# EAGLE design candle (EAGLE 6.6.0)
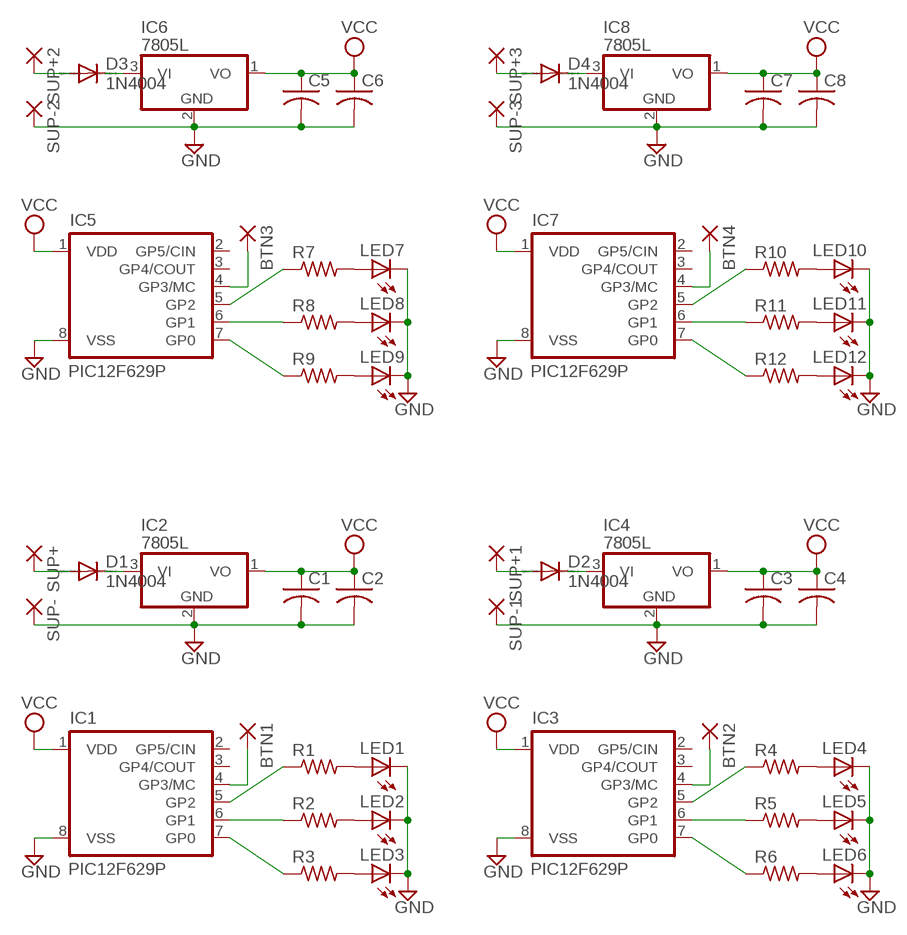
[diagram p0: schematic, sheet 1]

## Parts
BTN1  1,6/0,8  [1,6/0,8]
BTN2  1,6/0,8  [1,6/0,8]
BTN3  1,6/0,8  [1,6/0,8]
BTN4  1,6/0,8  [1,6/0,8]
C1  C-US025-025X050  [C025-025X050]
C2  C-US025-025X050  [C025-025X050]
C3  C-US025-025X050  [C025-025X050]
C4  C-US025-025X050  [C025-025X050]
C5  C-US025-025X050  [C025-025X050]
C6  C-US025-025X050  [C025-025X050]
C7  C-US025-025X050  [C025-025X050]
C8  C-US025-025X050  [C025-025X050]
D1  1N4004  [DO41-10]
D2  1N4004  [DO41-10]
D3  1N4004  [DO41-10]
D4  1N4004  [DO41-10]
IC1  PIC12F629P  PIC12C671P  [DIL8]
IC2  7805L  [TO92]
IC3  PIC12F629P  PIC12C671P  [DIL8]
IC4  7805L  [TO92]
IC5  PIC12F629P  PIC12C671P  [DIL8]
IC6  7805L  [TO92]
IC7  PIC12F629P  PIC12C671P  [DIL8]
IC8  7805L  [TO92]
LED1  LED5MM  [LED5MM]
LED2  LED5MM  [LED5MM]
LED3  LED5MM  [LED5MM]
LED4  LED5MM  [LED5MM]
LED5  LED5MM  [LED5MM]
LED6  LED5MM  [LED5MM]
LED7  LED5MM  [LED5MM]
LED8  LED5MM  [LED5MM]
LED9  LED5MM  [LED5MM]
LED10  LED5MM  [LED5MM]
LED11  LED5MM  [LED5MM]
LED12  LED5MM  [LED5MM]
R1  R-US_0204/7  [0204/7]
R2  R-US_0204/7  [0204/7]
R3  R-US_0204/7  [0204/7]
R4  R-US_0204/7  [0204/7]
R5  R-US_0204/7  [0204/7]
R6  R-US_0204/7  [0204/7]
R7  R-US_0204/7  [0204/7]
R8  R-US_0204/7  [0204/7]
R9  R-US_0204/7  [0204/7]
R10  R-US_0204/7  [0204/7]
R11  R-US_0204/7  [0204/7]
R12  R-US_0204/7  [0204/7]
SUP+  1,6/0,8  [1,6/0,8]
SUP+1  1,6/0,8  [1,6/0,8]
SUP+2  1,6/0,8  [1,6/0,8]
SUP+3  1,6/0,8  [1,6/0,8]
SUP-  1,6/0,8  [1,6/0,8]
SUP-1  1,6/0,8  [1,6/0,8]
SUP-2  1,6/0,8  [1,6/0,8]
SUP-3  1,6/0,8  [1,6/0,8]

## Nets
GND: C1.2 C2.2 C3.2 C4.2 C5.2 C6.2 C7.2 C8.2 IC1.8(VSS) IC2.2(GND) IC3.8(VSS) IC4.2(GND) IC5.8(VSS) IC6.2(GND) IC7.8(VSS) IC8.2(GND) LED1.K(C) LED2.K(C) LED3.K(C) LED4.K(C) LED5.K(C) LED6.K(C) LED7.K(C) LED8.K(C) LED9.K(C) LED10.K(C) LED11.K(C) LED12.K(C) SUP-1.1(P) SUP-2.1(P) SUP-3.1(P) SUP-.1(P)
N$1: IC3.7(GP0) R6.1
N$2: BTN1.1(P) IC1.4(GP3/MC)
N$3: IC1.7(GP0) R3.1
N$4: IC1.6(GP1) R2.1
N$5: IC1.5(GP2) R1.1
N$6: LED1.A R1.2
N$7: LED2.A R2.2
N$8: LED3.A R3.2
N$9: IC3.6(GP1) R5.1
N$10: D1.C IC2.3(VI)
N$11: IC3.5(GP2) R4.1
N$12: LED4.A R4.2
N$13: LED5.A R5.2
N$14: LED6.A R6.2
N$15: D2.C IC4.3(VI)
N$16: BTN2.1(P) IC3.4(GP3/MC)
N$17: IC5.7(GP0) R9.1
N$18: IC5.6(GP1) R8.1
N$19: IC5.5(GP2) R7.1
N$21: LED7.A R7.2
N$22: LED8.A R8.2
N$23: D3.C IC6.3(VI)
N$24: BTN3.1(P) IC5.4(GP3/MC)
N$25: IC7.7(GP0) R12.1
N$26: IC7.6(GP1) R11.1
N$27: IC7.5(GP2) R10.1
N$28: LED9.A R9.2
N$29: LED10.A R10.2
N$30: LED11.A R11.2
N$31: D4.C IC8.3(VI)
N$32: BTN4.1(P) IC7.4(GP3/MC)
N$33: D1.A SUP+.1(P)
N$34: LED12.A R12.2
N$35: D3.A SUP+2.1(P)
N$36: D4.A SUP+3.1(P)
N$37: D2.A SUP+1.1(P)
VCC: C1.1 C2.1 C3.1 C4.1 C5.1 C6.1 C7.1 C8.1 IC1.1(VDD) IC2.1(VO) IC3.1(VDD) IC4.1(VO) IC5.1(VDD) IC6.1(VO) IC7.1(VDD) IC8.1(VO)
Unconnected: IC1.2(GP5/CIN) IC1.3(GP4/COUT) IC3.2(GP5/CIN) IC3.3(GP4/COUT) IC5.2(GP5/CIN) IC5.3(GP4/COUT) IC7.2(GP5/CIN) IC7.3(GP4/COUT)

## Library data of the parts
BTN1-BTN4 SUP+ SUP+1-SUP+3 SUP- SUP-1-SUP-3 = wirepad:1,6/0,8: THROUGH-HOLE PAD
C1-C8 = rcl:C-US: CAPACITOR, American symbol
D1-D4 = diode:1N4004: DIODE general purpose rectifier, 1 A
IC1 IC3 IC5 IC7 = microchip:PIC12C*?: MICROCONTROLLER; MF: MICROCHIP; MPN: PIC12C671-10/P; OC_FARNELL: 9758860; OC_NEWARK: 23C2974
IC2 IC4 IC6 IC8 = linear:78*: Positive VOLTAGE REGULATOR Source: http://cache.national.com/ds/LM/LM78L05.pdf http://www.fairchildsemi.com/ds/LM/LM7805.pdf
LED1-LED12 = led:LED: LED OSRAM: - CHIPLED LG R971, LG N971, LY N971, LG Q971, LY Q971, LO R971, LY R971 LH N974, LH R974 LS Q976, LO Q976, LY Q976 LO Q996 - Hyper CHIPLED LW Q18S LB Q993, LB Q99A, LB R99A - SideLED LS A670, LO A670, LY A670, LG A670, LP A670 LB A673, LV A673, LT A673, LW A673 LH A674 LY A675 LS A676, LA A676, LO A676, LY A676, LW A676 LS A679, LY A679, LG A679 - Hyper Micro SIDELED® LS Y876, LA Y876, LO Y876, LY Y876 LT Y87S - SmartLED LW L88C, LW L88S LB L89C, LB L89S, LG L890 LS L89K, LO L89K, LY L89K LS L896, LA L896, LO L896, LY L896 - TOPLED LS T670, LO T670, LY T670, LG T670, LP T670 LSG T670, LSP T670, LSY T670, LOP T670, LYG T670 LG T671, LOG T671, LSG T671 LB T673, LV T673, LT T673, LW T673 LH T674 LS T676, LA T676, LO T676, LY T676, LB T676, LH T676, LSB T676, LW T676 LB T67C, LV T67C, LT T67C, LS T67K, LO T67K, LY T67K, LW E67C LS E67B, LA E67B, LO E67B, LY E67B, LB E67C, LV E67C, LT E67C LW T67C LS T679, LY T679, LG T679 LS T770, LO T770, LY T770, LG T770, LP T770 LB T773, LV T773, LT T773, LW T773 LH T774 LS E675, LA E675, LY E675, LS T675 LS T776, LA T776, LO T776, LY T776, LB T776 LHGB T686 LT T68C, LB T68C - Hyper Mini TOPLED® LB M676 - Mini TOPLED Santana® LG M470 LS M47K, LO M47K, LY M47K Source: http://www.osram.convergy.de LUXEON: - LUMILED® LXK2-PW12-R00, LXK2-PW12-S00, LXK2-PW14-U00, LXK2-PW14-V00 LXK2-PM12-R00, LXK2-PM12-S00, LXK2-PM14-U00 LXK2-PE12-Q00, LXK2-PE12-R00, LXK2-PE12-S00, LXK2-PE14-T00, LXK2-PE14-U00 LXK2-PB12-K00, LXK2-PB12-L00, LXK2-PB12-M00, LXK2-PB14-N00, LXK2-PB14-P00, LXK2-PB14-Q00 LXK2-PR12-L00, LXK2-PR12-M00, LXK2-PR14-Q00, LXK2-PR14-R00 LXK2-PD12-Q00, LXK2-PD12-R00, LXK2-PD12-S00 LXK2-PH12-R00, LXK2-PH12-S00 LXK2-PL12-P00, LXK2-PL12-Q00, LXK2-PL12-R00 Source: www.luxeon.com KINGBRIGHT: KA-3528ASYC Source: www.kingbright.com
R1-R12 = rcl:R-US_: RESISTOR, American symbol

## Board
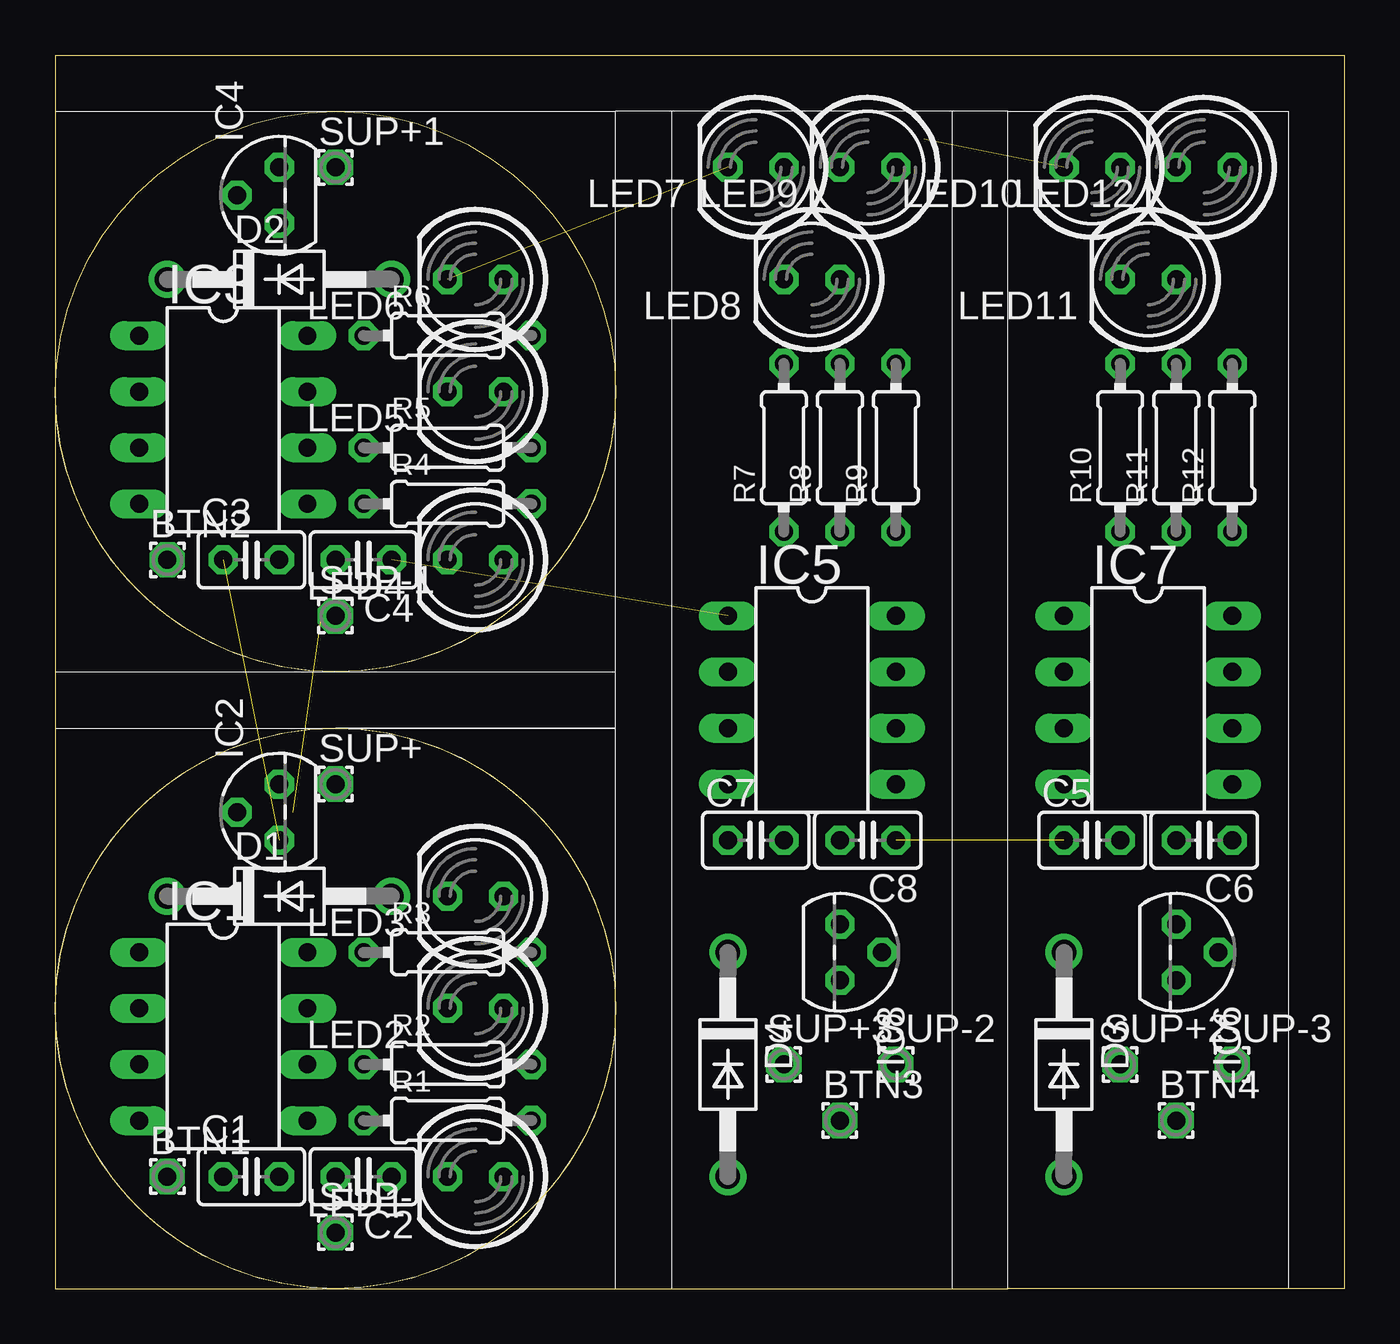
[diagram p1: board, top side]
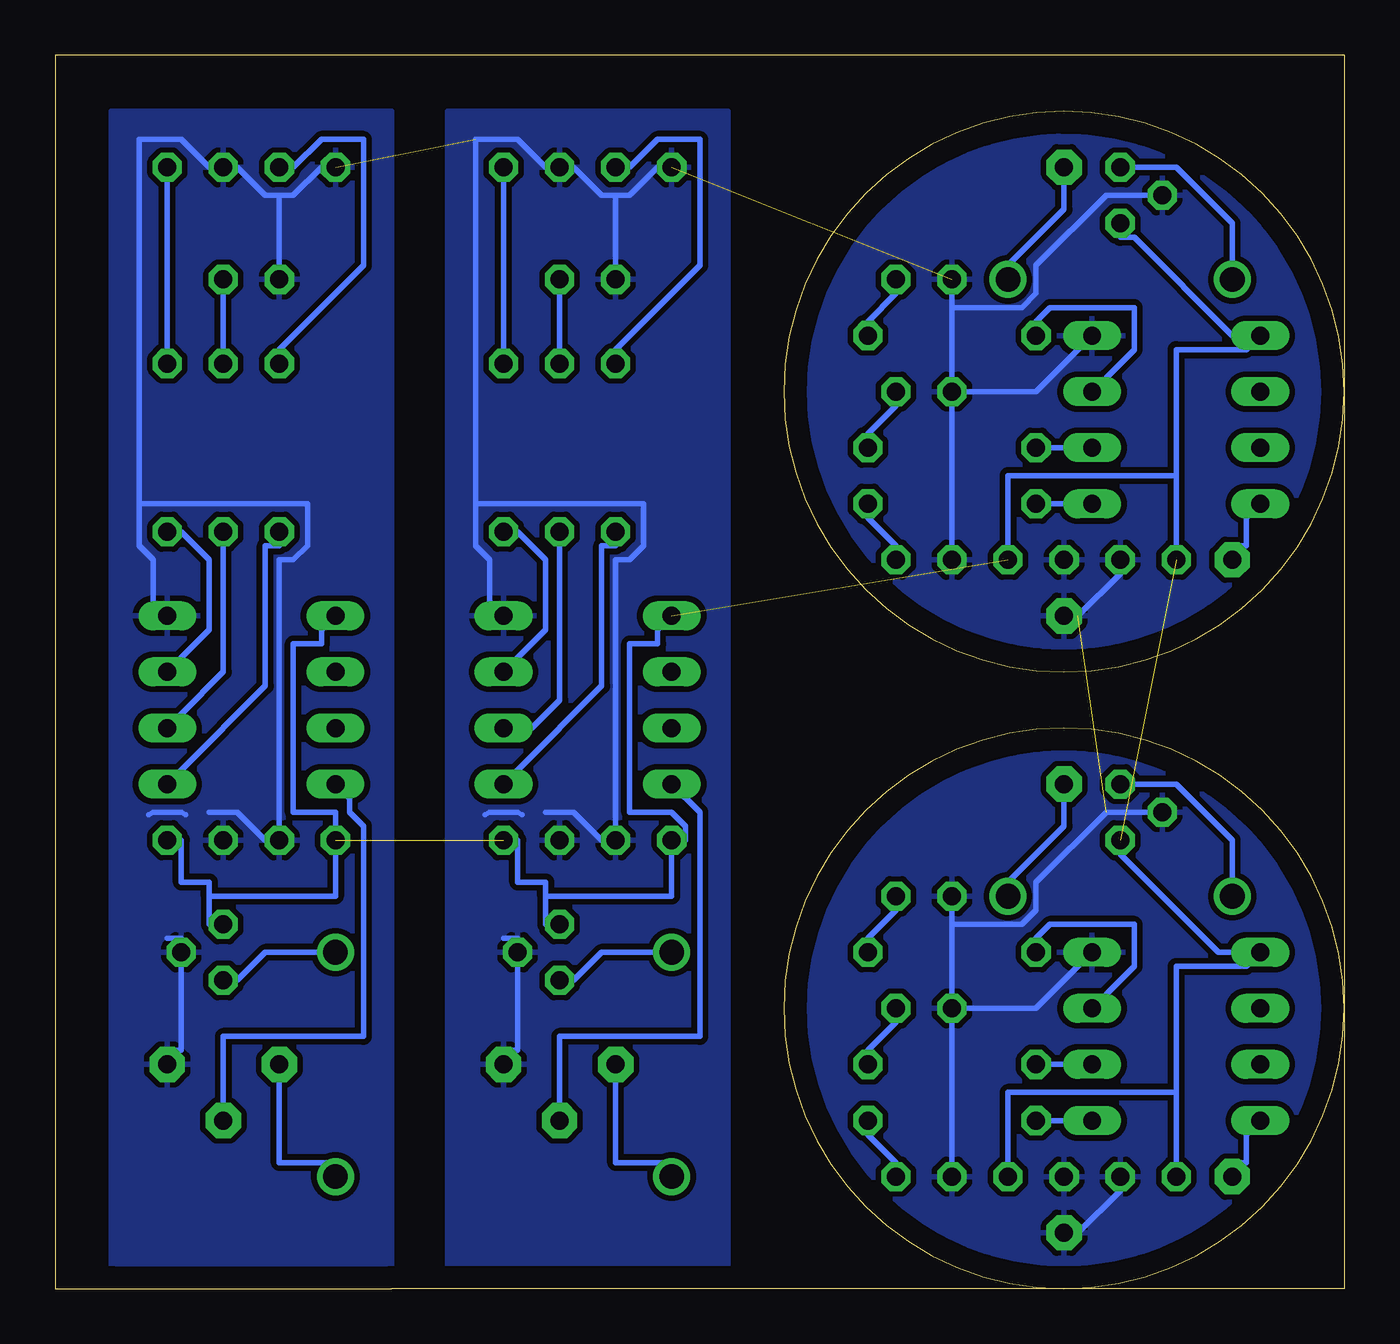
[diagram p2: board, bottom side, seen from below]

Size 58.42 x 55.88 mm. Coordinates in mm from the lower left corner, seen from the top.
Outline: 0,12.7 0,25.4 0,27.94 0,40.64
Outline: 0,12.7 0,0 12.7,0 25.4,0 27.94,0 40.64,0 43.18,0 55.88,0 58.42,0 58.42,55.88 0,55.88 0,53.34 0,40.64
Outline: 0,40.64 arc-180 25.4,40.64 arc-180 0,40.64
Outline: 0,12.7 arc-180 25.4,12.7 arc-180 0,12.7
Copper layers (1*16): Top 0.035mm / dielectric 1.5mm / Bottom 0.035mm
Design rules "10mils": minimum track width 10mil, minimum drill 24mil, track to track 10mil, track to pad 10mil, pad to pad 10mil, via to via 10mil, smd to smd 10mil, copper to edge 40mil, drill to drill 10mil, minimum pad ring 10mil, minimum via ring 8mil, stop-mask expansion 0mil, vias tented up to drill 0mil, thermal gap 10mil

### Footprints (pad centres in the part's own frame; a part is rotated, then mirrored left to right if it is on the bottom)
1,6/0,8 = drill 0.813 pad 1.6 octagon: 1 0,0
C025-025X050 = drill 0.813 octagon: 1 -1.27,0; 2 1.27,0
DO41-10 = drill 1.118: A 5.08,0; C -5.08,0
DIL8 = drill 0.813 long: 1 -3.81,-3.81; 2 -1.27,-3.81; 3 1.27,-3.81; 4 3.81,-3.81; 5 3.81,3.81; 6 1.27,3.81; 7 -1.27,3.81; 8 -3.81,3.81
TO92 = drill 0.813 octagon: 1 -1.27,0; 2 0,1.905; 3 1.27,0
LED5MM = drill 0.813 octagon: A -1.27,0; K 1.27,0
0204/7 = drill 0.813 octagon: 1 -3.81,0; 2 3.81,0

### Placement (x,y rotation side)
BTN1  5.08,5.08 0 top
BTN2  5.08,33.02 0 top
BTN3  35.56,7.62 0 top
BTN4  50.8,7.62 0 top
C1  8.89,5.08 0 top
C2  13.97,5.08 180 top
C3  8.89,33.02 0 top
C4  13.97,33.02 180 top
C5  46.99,20.32 0 top
C6  52.07,20.32 180 top
C7  31.75,20.32 0 top
C8  36.83,20.32 180 top
D1  10.16,17.78 0 top
D2  10.16,45.72 0 top
D3  45.72,10.16 270 top
D4  30.48,10.16 270 top
IC1  7.62,11.43 270 top
IC2  10.16,21.59 90 top
IC3  7.62,39.37 270 top
IC4  10.16,49.53 90 top
IC5  34.29,26.67 270 top
IC6  50.8,15.24 270 top
IC7  49.53,26.67 270 top
IC8  35.56,15.24 270 top
LED1  19.05,5.08 180 top
LED2  19.05,12.7 180 top
LED3  19.05,17.78 180 top
LED4  19.05,33.02 180 top
LED5  19.05,40.64 180 top
LED6  19.05,45.72 180 top
LED7  31.75,50.8 180 top
LED8  34.29,45.72 180 top
LED9  36.83,50.8 180 top
LED10  46.99,50.8 180 top
LED11  49.53,45.72 180 top
LED12  52.07,50.8 180 top
R1  17.78,7.62 0 top
R2  17.78,10.16 0 top
R3  17.78,15.24 0 top
R4  17.78,35.56 0 top
R5  17.78,38.1 0 top
R6  17.78,43.18 0 top
R7  33.02,38.1 90 top
R8  35.56,38.1 90 top
R9  38.1,38.1 90 top
R10  48.26,38.1 90 top
R11  50.8,38.1 90 top
R12  53.34,38.1 90 top
SUP+  12.7,22.86 0 top
SUP+1  12.7,50.8 0 top
SUP+2  48.26,10.16 0 top
SUP+3  33.02,10.16 0 top
SUP-  12.7,2.54 0 top
SUP-1  12.7,30.48 0 top
SUP-2  38.1,10.16 0 top
SUP-3  53.34,10.16 0 top

### Tracks (layer width: path | path; a pad name or v marks a point on that pad's centre or on a via)
GND  (3 unrouted)
  Bottom 0.254: 36.2,21.59 34.92,21.59 33.66,20.32 C7.2 33.02,20.95 33.02,33.02 32.38,33.02 31.75,33.66 31.75,35.56 39.37,35.56 | SUP-2.1 38.1,10.79 37.47,10.79 37.47,14.61 IC8.2 37.47,15.88 38.1,15.88 | 33.02,49.53 33.02,46.35 LED8.K | 33.02,49.53 32.38,49.53 31.11,50.8 LED7.K | 39.37,35.56 39.37,52.07 37.47,52.07 36.2,50.8 LED9.K 34.92,50.8 33.66,49.53 33.02,49.53 | 39.37,35.56 39.37,33.66 38.73,33.02 38.73,31.11 IC5.8 | 51.44,21.59 50.16,21.59 48.9,20.32 C5.2 48.26,20.95 48.26,33.02 47.62,33.02 46.99,33.66 46.99,35.56 54.61,35.56 | SUP-3.1 53.34,10.79 52.7,10.79 52.7,14.61 IC6.2 52.7,15.88 53.34,15.88 | 48.26,49.53 48.26,46.35 LED11.K | 48.26,49.53 47.62,49.53 46.35,50.8 LED10.K | 54.61,35.56 54.61,52.07 52.7,52.07 51.44,50.8 LED12.K 50.16,50.8 48.9,49.53 48.26,49.53 | 54.61,35.56 54.61,33.66 53.98,33.02 53.98,31.11 IC7.8 | C3.2 10.16,32.38 12.06,30.48 SUP-1.1 13.34,30.48 | IC3.8 12.06,42.55 13.97,40.64 17.14,40.64 LED5.K | 17.78,44.45 17.78,41.27 LED5.K | 17.78,44.45 17.78,45.09 LED6.K | 17.78,44.45 14.61,44.45 13.97,45.09 13.97,46.35 10.79,49.53 8.89,49.53 IC4.2 | LED4.K 17.78,33.66 17.78,40.01 LED5.K | C1.2 10.16,4.45 12.06,2.54 SUP-.1 13.34,2.54 | IC1.8 12.06,14.61 13.97,12.7 17.14,12.7 LED2.K | 17.78,16.51 17.78,13.34 LED2.K | 17.78,16.51 17.78,17.14 LED3.K | 17.78,16.51 14.61,16.51 13.97,17.14 13.97,18.41 10.79,21.59 8.89,21.59 IC2.2 | LED1.K 17.78,5.71 17.78,12.06 LED2.K | 54.17,21.46 53.98,21.59 52.7,21.59 52.51,21.46 | 38.93,21.46 38.73,21.59 37.47,21.59 37.27,21.46
  pour Bottom (isolate 0.254): 0,53.34 25.4,53.34 25.4,27.94 0,27.94
  pour Bottom (isolate 0.254): 0,25.4 25.4,25.4 25.4,0 0,0
  pour Bottom (isolate 0.254): 27.94,53.34 40.64,53.34 40.64,0 27.94,0
  pour Bottom (isolate 0.254): 43.18,53.34 55.88,53.34 55.88,0 43.18,0
N$1
  Bottom 0.254: IC3.7 10.79,41.27 9.53,42.55 9.53,44.45 13.34,44.45 13.97,43.81 R6.1
N$2
  Bottom 0.254: IC1.4 4.45,6.99 4.45,5.71 5.08,5.71 BTN1.1
N$3
  Bottom 0.254: IC1.7 10.79,13.34 9.53,14.61 9.53,16.51 13.34,16.51 13.97,15.88 R3.1
N$4
  Bottom 0.254: IC1.6 12.7,10.16 13.34,10.16 R2.1
N$5
  Bottom 0.254: IC1.5 12.7,7.62 13.34,7.62 R1.1
N$6
  Bottom 0.254: LED1.A 20.32,5.71 21.59,6.99 R1.2
N$7
  Bottom 0.254: R2.2 21.59,10.79 20.32,12.06 LED2.A
N$8
  Bottom 0.254: R3.2 21.59,15.88 20.32,17.14 LED3.A
N$9
  Bottom 0.254: IC3.6 12.7,38.1 13.34,38.1 R5.1
N$10
  Bottom 0.254: D1.C 5.08,20.32 7.62,22.86 IC2.3
N$11
  Bottom 0.254: IC3.5 12.7,35.56 13.34,35.56 R4.1
N$12
  Bottom 0.254: LED4.A 20.32,33.66 21.59,34.92 R4.2
N$13
  Bottom 0.254: R5.2 21.59,38.73 20.32,40.01 LED5.A
N$14
  Bottom 0.254: R6.2 21.59,43.81 20.32,45.09 LED6.A
N$15
  Bottom 0.254: D2.C 5.08,48.26 7.62,50.8 IC4.3
N$16
  Bottom 0.254: IC3.4 4.45,34.92 4.45,33.66 5.08,33.66 BTN2.1
N$17
  Bottom 0.254: IC5.7 37.47,28.57 36.2,29.84 36.2,33.02 37.47,34.29 R9.1
N$18
  Bottom 0.254: R8.1 35.56,33.66 35.56,26.67 36.83,25.4 IC5.6
N$19
  Bottom 0.254: IC5.5 37.47,23.5 33.66,27.3 33.66,33.66 33.02,33.66 R7.1
N$21
  Bottom 0.254: R7.2 33.02,42.55 29.21,46.35 29.21,52.07 31.11,52.07 32.38,50.8 LED7.A
N$22
  Bottom 0.254: R8.2 35.56,42.55 35.56,45.09 LED8.A
N$23
  Bottom 0.254: IC6.3 50.16,13.97 48.9,15.24 46.35,15.24 D3.C
N$24
  Bottom 0.254: IC5.4 29.21,21.59 29.21,11.43 35.56,11.43 BTN3.1
N$25
  Bottom 0.254: IC7.7 52.7,28.57 51.44,29.84 51.44,33.02 52.7,34.29 R12.1
N$26
  Bottom 0.254: IC7.6 52.7,26.04 50.8,27.94 50.8,33.66 R11.1
N$27
  Bottom 0.254: IC7.5 52.7,23.5 48.9,27.3 48.9,33.66 48.26,33.66 R10.1
N$28
  Bottom 0.254: R9.2 38.1,42.55 38.1,50.16 LED9.A
N$29
  Bottom 0.254: R10.2 48.26,42.55 44.45,46.35 44.45,52.07 46.35,52.07 47.62,50.8 LED10.A
N$30
  Bottom 0.254: R11.2 50.8,42.55 50.8,45.09 LED11.A
N$31
  Bottom 0.254: IC8.3 34.92,13.97 33.66,15.24 31.11,15.24 D4.C
N$32
  Bottom 0.254: IC7.4 45.09,22.23 45.09,21.59 44.45,20.95 44.45,11.43 50.8,11.43 BTN4.1
N$33
  Bottom 0.254: SUP+.1 12.7,22.23 12.7,20.95 15.24,18.41 D1.A
N$34
  Bottom 0.254: R12.2 53.34,42.55 53.34,50.16 LED12.A
N$35
  Bottom 0.254: SUP+2.1 48.26,9.53 48.26,5.71 45.72,5.71 D3.A
N$36
  Bottom 0.254: SUP+3.1 33.02,9.53 33.02,5.71 30.48,5.71 D4.A
N$37
  Bottom 0.254: SUP+1.1 12.7,50.16 12.7,48.9 15.24,46.35 D2.A
VCC  (3 unrouted)
  Bottom 0.254: IC4.1 10.16,47.62 9.53,47.62 5.08,43.18 IC3.1 4.45,42.55 7.62,42.55 7.62,36.83 | 7.62,36.83 7.62,34.29 7.62,33.66 C3.1 | 7.62,8.89 7.62,6.35 7.62,5.71 C1.1 | 7.62,8.89 7.62,14.61 4.45,14.61 IC1.1 5.08,15.24 5.71,15.24 10.16,19.68 IC2.1 | 7.62,8.89 15.24,8.89 15.24,5.71 C2.1 | 7.62,36.83 15.24,36.83 15.24,33.66 C4.1 | 36.2,17.78 36.2,18.41 37.47,18.41 37.47,20.32 C8.1 | 36.2,17.78 36.2,16.51 IC8.1 | 36.2,17.78 30.48,17.78 30.48,19.68 C7.1 29.84,20.32 29.84,20.95 30.48,21.59 32.38,21.59 32.38,29.21 31.11,29.21 31.11,29.84 IC5.1 | 51.44,17.78 51.44,18.41 52.7,18.41 52.7,20.32 C6.1 | 51.44,17.78 51.44,16.51 IC6.1 | 51.44,17.78 45.72,17.78 45.72,19.68 C5.1 45.72,20.95 45.72,21.59 47.62,21.59 47.62,29.21 46.35,29.21 46.35,29.84 IC7.1